# EAGLE design remotetool (EAGLE 7.0.0)
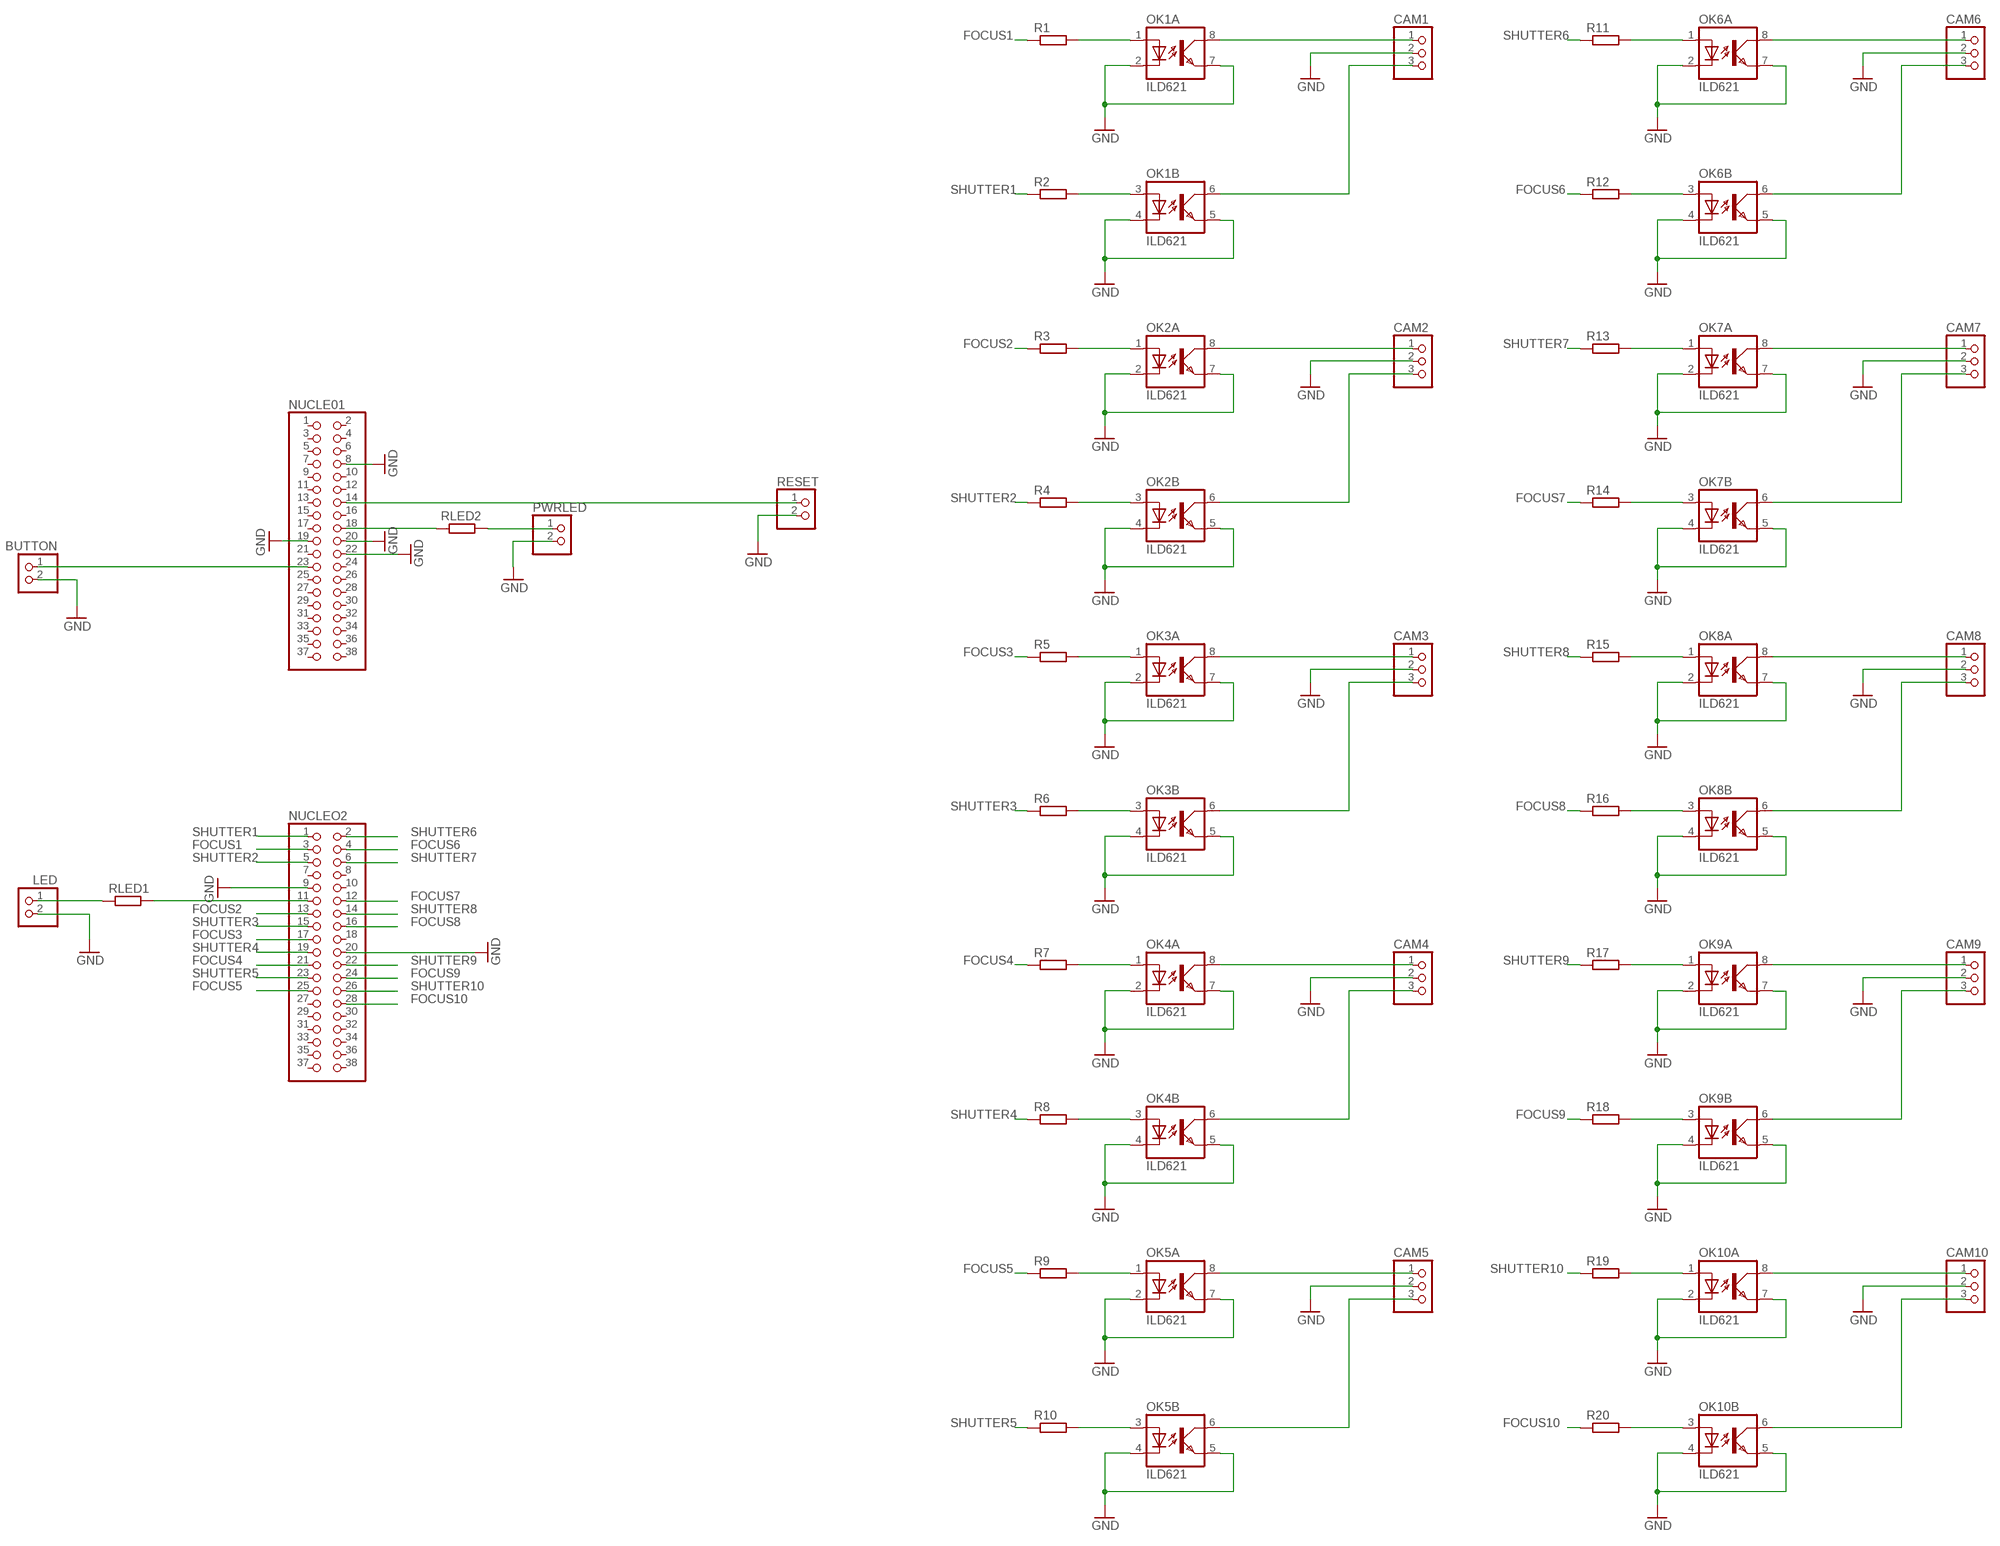
[diagram p0: schematic, sheet 1]

## Parts
BUTTON  PINHD-1X2  [1X02]
CAM1  PINHD-1X3  [1X03]
CAM2  PINHD-1X3  [1X03]
CAM3  PINHD-1X3  [1X03]
CAM4  PINHD-1X3  [1X03]
CAM5  PINHD-1X3  [1X03]
CAM6  PINHD-1X3  [1X03]
CAM7  PINHD-1X3  [1X03]
CAM8  PINHD-1X3  [1X03]
CAM9  PINHD-1X3  [1X03]
CAM10  PINHD-1X3  [1X03]
LED  PINHD-1X2  [1X02]
NUCLE01  PINHD-2X19  [2X19]
NUCLEO2  PINHD-2X19  [2X19]
OK1  ILD621  [DIL08]
OK2  ILD621  [DIL08]
OK3  ILD621  [DIL08]
OK4  ILD621  [DIL08]
OK5  ILD621  [DIL08]
OK6  ILD621  [DIL08]
OK7  ILD621  [DIL08]
OK8  ILD621  [DIL08]
OK9  ILD621  [DIL08]
OK10  ILD621  [DIL08]
PWRLED  PINHD-1X2  [1X02]
R1  R-EU_0207/2V  [0207/2V]
R2  R-EU_0207/2V  [0207/2V]
R3  R-EU_0207/2V  [0207/2V]
R4  R-EU_0207/2V  [0207/2V]
R5  R-EU_0207/2V  [0207/2V]
R6  R-EU_0207/2V  [0207/2V]
R7  R-EU_0207/2V  [0207/2V]
R8  R-EU_0207/2V  [0207/2V]
R9  R-EU_0207/2V  [0207/2V]
R10  R-EU_0207/2V  [0207/2V]
R11  R-EU_0207/2V  [0207/2V]
R12  R-EU_0207/2V  [0207/2V]
R13  R-EU_0207/2V  [0207/2V]
R14  R-EU_0207/2V  [0207/2V]
R15  R-EU_0207/2V  [0207/2V]
R16  R-EU_0207/2V  [0207/2V]
R17  R-EU_0207/2V  [0207/2V]
R18  R-EU_0207/2V  [0207/2V]
R19  R-EU_0207/2V  [0207/2V]
R20  R-EU_0207/2V  [0207/2V]
RESET  PINHD-1X2  [1X02]
RLED1  R-EU_0207/2V  [0207/2V]
RLED2  R-EU_0207/2V  [0207/2V]

## Nets
FOCUS1: NUCLEO2.3 R1.1
FOCUS2: NUCLEO2.13 R3.1
FOCUS3: NUCLEO2.17 R5.1
FOCUS4: NUCLEO2.21 R7.1
FOCUS5: NUCLEO2.25 R9.1
FOCUS6: NUCLEO2.4 R12.1
FOCUS7: NUCLEO2.12 R14.1
FOCUS8: NUCLEO2.16 R16.1
FOCUS9: NUCLEO2.24 R18.1
FOCUS10: NUCLEO2.28 R20.1
GND: BUTTON.2 CAM1.2 CAM2.2 CAM3.2 CAM4.2 CAM5.2 CAM6.2 CAM7.2 CAM8.2 CAM9.2 CAM10.2 LED.2 NUCLE01.8 NUCLE01.19 NUCLE01.20 NUCLE01.22 NUCLEO2.9 NUCLEO2.20 OK1.2(A:C) OK1.4(B:C) OK1.5(B:EMIT) OK1.7(A:EMIT) OK2.2(A:C) OK2.4(B:C) OK2.5(B:EMIT) OK2.7(A:EMIT) OK3.2(A:C) OK3.4(B:C) OK3.5(B:EMIT) OK3.7(A:EMIT) OK4.2(A:C) OK4.4(B:C) OK4.5(B:EMIT) OK4.7(A:EMIT) OK5.2(A:C) OK5.4(B:C) OK5.5(B:EMIT) OK5.7(A:EMIT) OK6.2(A:C) OK6.4(B:C) OK6.5(B:EMIT) OK6.7(A:EMIT) OK7.2(A:C) OK7.4(B:C) OK7.5(B:EMIT) OK7.7(A:EMIT) OK8.2(A:C) OK8.4(B:C) OK8.5(B:EMIT) OK8.7(A:EMIT) OK9.2(A:C) OK9.4(B:C) OK9.5(B:EMIT) OK9.7(A:EMIT) OK10.2(A:C) OK10.4(B:C) OK10.5(B:EMIT) OK10.7(A:EMIT) PWRLED.2 RESET.2
N$1: OK1.1(A:A) R1.2
N$2: OK1.3(B:A) R2.2
N$3: CAM1.1 OK1.8(A:COL)
N$4: CAM1.3 OK1.6(B:COL)
N$5: OK2.1(A:A) R3.2
N$6: OK2.3(B:A) R4.2
N$7: CAM2.1 OK2.8(A:COL)
N$8: CAM2.3 OK2.6(B:COL)
N$9: OK3.1(A:A) R5.2
N$10: OK3.3(B:A) R6.2
N$11: CAM3.1 OK3.8(A:COL)
N$12: CAM3.3 OK3.6(B:COL)
N$13: OK4.1(A:A) R7.2
N$14: OK4.3(B:A) R8.2
N$15: CAM4.1 OK4.8(A:COL)
N$16: CAM4.3 OK4.6(B:COL)
N$17: OK5.1(A:A) R9.2
N$18: OK5.3(B:A) R10.2
N$19: CAM5.1 OK5.8(A:COL)
N$20: CAM5.3 OK5.6(B:COL)
N$21: OK6.1(A:A) R11.2
N$22: OK6.3(B:A) R12.2
N$23: CAM6.1 OK6.8(A:COL)
N$24: CAM6.3 OK6.6(B:COL)
N$25: OK7.1(A:A) R13.2
N$26: OK7.3(B:A) R14.2
N$27: CAM7.1 OK7.8(A:COL)
N$28: CAM7.3 OK7.6(B:COL)
N$29: OK8.1(A:A) R15.2
N$30: OK8.3(B:A) R16.2
N$31: CAM8.1 OK8.8(A:COL)
N$32: CAM8.3 OK8.6(B:COL)
N$33: OK9.1(A:A) R17.2
N$34: OK9.3(B:A) R18.2
N$35: CAM9.1 OK9.8(A:COL)
N$36: CAM9.3 OK9.6(B:COL)
N$37: OK10.1(A:A) R19.2
N$38: OK10.3(B:A) R20.2
N$39: CAM10.1 OK10.8(A:COL)
N$40: CAM10.3 OK10.6(B:COL)
N$41: NUCLEO2.11 RLED1.2
N$42: BUTTON.1 NUCLE01.23
N$43: NUCLE01.14 RESET.1
N$44: LED.1 RLED1.1
N$45: NUCLE01.18 RLED2.2
N$46: PWRLED.1 RLED2.1
SHUTTER1: NUCLEO2.1 R2.1
SHUTTER2: NUCLEO2.5 R4.1
SHUTTER3: NUCLEO2.15 R6.1
SHUTTER4: NUCLEO2.19 R8.1
SHUTTER5: NUCLEO2.23 R10.1
SHUTTER6: NUCLEO2.2 R11.1
SHUTTER7: NUCLEO2.6 R13.1
SHUTTER8: NUCLEO2.14 R15.1
SHUTTER9: NUCLEO2.22 R17.1
SHUTTER10: NUCLEO2.26 R19.1
Unconnected: NUCLE01.1 NUCLE01.2 NUCLE01.3 NUCLE01.4 NUCLE01.5 NUCLE01.6 NUCLE01.7 NUCLE01.9 NUCLE01.10 NUCLE01.11 NUCLE01.12 NUCLE01.13 NUCLE01.15 NUCLE01.16 NUCLE01.17 NUCLE01.21 NUCLE01.24 NUCLE01.25 NUCLE01.26 NUCLE01.27 NUCLE01.28 NUCLE01.29 NUCLE01.30 NUCLE01.31 NUCLE01.32 NUCLE01.33 NUCLE01.34 NUCLE01.35 NUCLE01.36 NUCLE01.37 NUCLE01.38 NUCLEO2.7 NUCLEO2.8 NUCLEO2.10 NUCLEO2.18 NUCLEO2.27 NUCLEO2.29 NUCLEO2.30 NUCLEO2.31 NUCLEO2.32 NUCLEO2.33 NUCLEO2.34 NUCLEO2.35 NUCLEO2.36 NUCLEO2.37 NUCLEO2.38

## Library data of the parts
BUTTON LED PWRLED RESET = pinhead:PINHD-1X2: PIN HEADER
CAM1-CAM10 = pinhead:PINHD-1X3: PIN HEADER
NUCLE01 NUCLEO2 = pinhead:PINHD-2X19: PIN HEADER
OK1-OK10 = optocoupler:ILD621: SIEMENS OPTO COUPLER; MF: VISHAY/TELEFUNKEN; MPN: ILD621; OC_FARNELL: 1020151; OC_NEWARK: 58K1678
R1-R20 RLED1 RLED2 = resistor:R-EU_: RESISTOR, European symbol

## Board
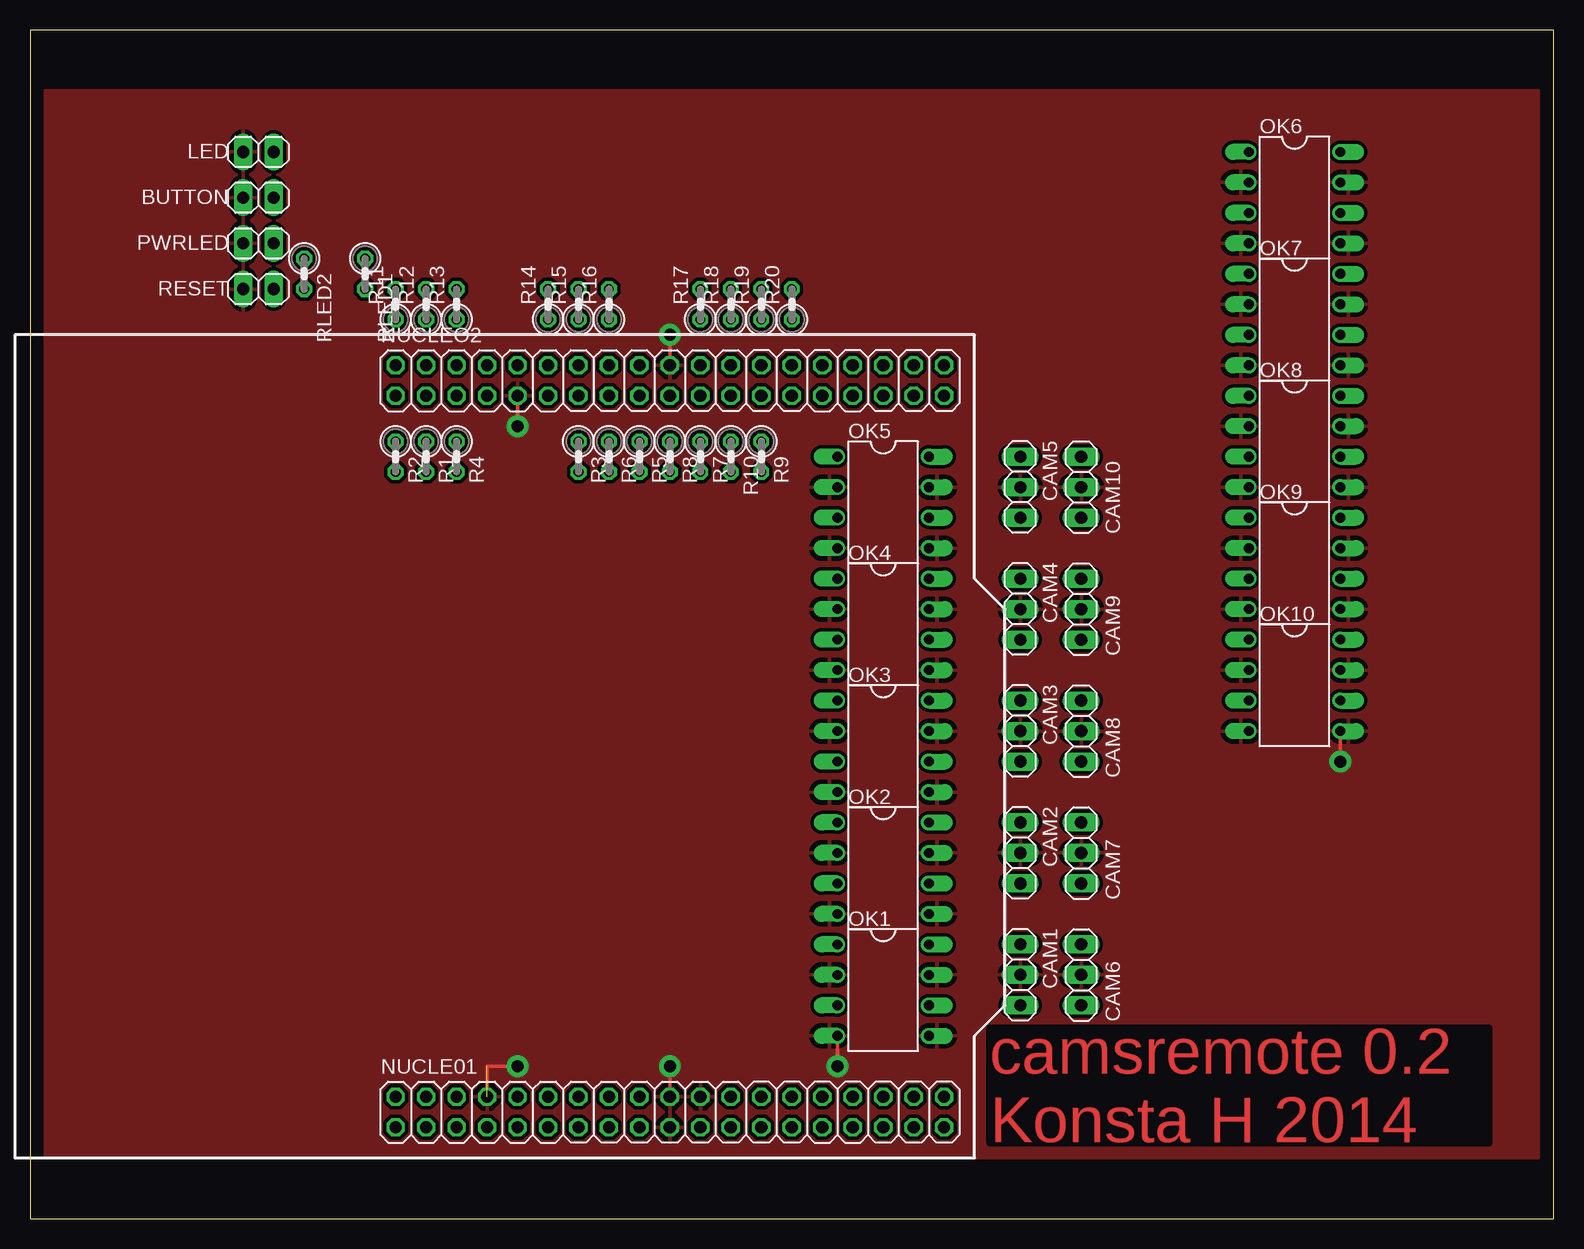
[diagram p1: board, top side]
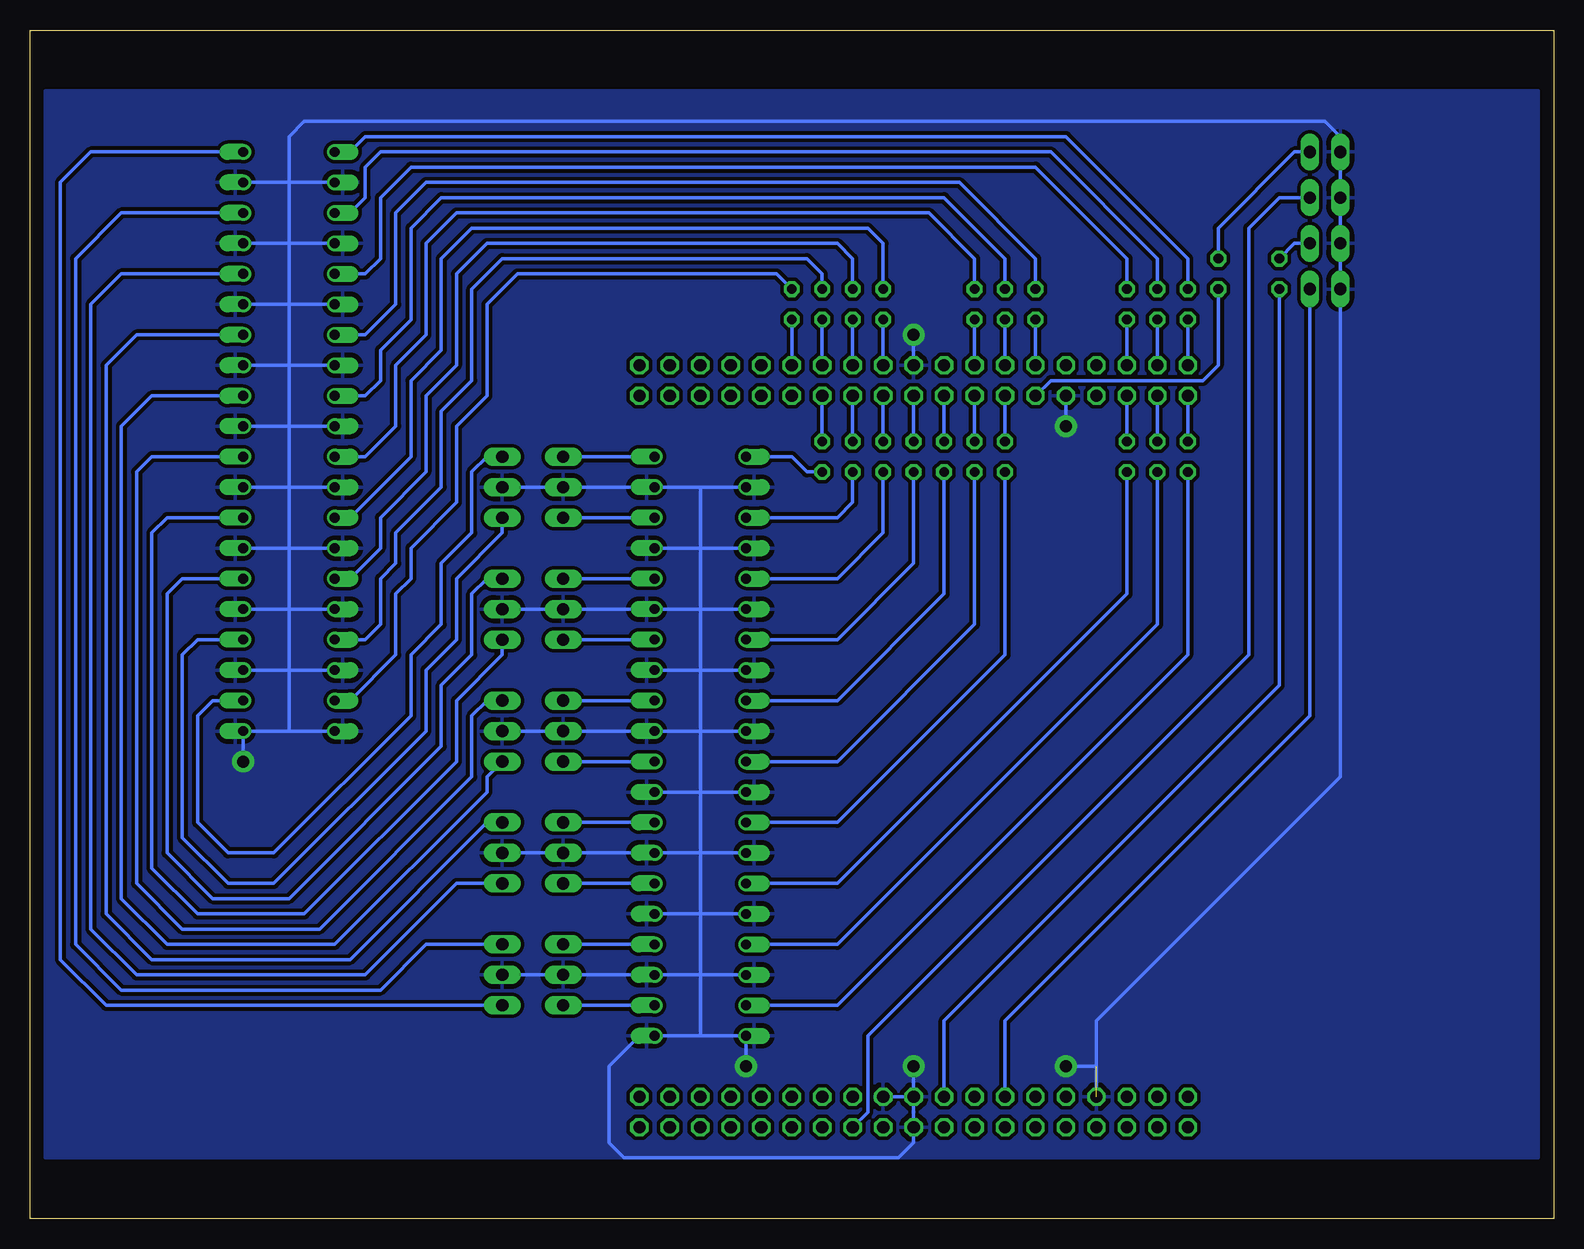
[diagram p2: board, bottom side, seen from below]

Size 127 x 99.06 mm. Coordinates in mm from the lower left corner, seen from the top.
Outline: 0,0 127,0 127,99.06 0,99.06 0,0
Copper layers (1*16): Top 0.035mm / dielectric 1.5mm / Bottom 0.035mm
Design rules "default *": minimum track width 10mil, minimum drill 24mil, track to track 12mil, track to pad 12mil, pad to pad 12mil, via to via 12mil, smd to smd 10mil, copper to edge 40mil, drill to drill 16mil, minimum pad ring 10mil, minimum via ring 16mil, stop-mask expansion 4mil, vias tented up to drill 0mil, thermal gap 16mil

### Footprints (pad centres in the part's own frame; a part is rotated, then mirrored left to right if it is on the bottom)
1X02 = drill 1.016 long: 1 -1.27,0; 2 1.27,0
1X03 = drill 1.016 long: 1 -2.54,0; 2 0,0; 3 2.54,0
2X19 = drill 1.016 octagon: 1 -22.86,-1.27; 2 -22.86,1.27; 3 -20.32,-1.27; 4 -20.32,1.27; 5 -17.78,-1.27; 6 -17.78,1.27; 7 -15.24,-1.27; 8 -15.24,1.27; 9 -12.7,-1.27; 10 -12.7,1.27; 11 -10.16,-1.27; 12 -10.16,1.27; 13 -7.62,-1.27; 14 -7.62,1.27; 15 -5.08,-1.27; 16 -5.08,1.27; 17 -2.54,-1.27; 18 -2.54,1.27; 19 0,-1.27; 20 0,1.27; 21 2.54,-1.27; 22 2.54,1.27; 23 5.08,-1.27; 24 5.08,1.27; 25 7.62,-1.27; 26 7.62,1.27; 27 10.16,-1.27; 28 10.16,1.27; 29 12.7,-1.27; 30 12.7,1.27; 31 15.24,-1.27; 32 15.24,1.27; 33 17.78,-1.27; 34 17.78,1.27; 35 20.32,-1.27; 36 20.32,1.27; 37 22.86,-1.27; 38 22.86,1.27
DIL08 = drill 0.813 offset: 1 -3.81,-3.81; 2 -1.27,-3.81; 3 1.27,-3.81; 4 3.81,-3.81; 5 3.81,3.81; 6 1.27,3.81; 7 -1.27,3.81; 8 -3.81,3.81
0207/2V = drill 0.813 octagon: 1 -1.27,0; 2 1.27,0

### Placement (x,y rotation side)
BUTTON  19.05,85.09 180 top
CAM1  82.55,20.32 270 top
CAM2  82.55,30.48 270 top
CAM3  82.55,40.64 270 top
CAM4  82.55,50.8 270 top
CAM5  82.55,60.96 270 top
CAM6  87.63,20.32 90 top
CAM7  87.63,30.48 90 top
CAM8  87.63,40.64 90 top
CAM9  87.63,50.8 90 top
CAM10  87.63,60.96 90 top
LED  19.05,88.9 180 top
NUCLE01  53.34,8.89 0 top
NUCLEO2  53.34,69.85 0 top
OK1  71.12,19.05 270 top
OK2  71.12,29.21 270 top
OK3  71.12,39.37 270 top
OK4  71.12,49.53 270 top
OK5  71.12,59.69 270 top
OK6  105.41,85.09 270 top
OK7  105.41,74.93 270 top
OK8  105.41,64.77 270 top
OK9  105.41,54.61 270 top
OK10  105.41,44.45 270 top
PWRLED  19.05,81.28 180 top
R1  33.02,63.5 270 top
R2  30.48,63.5 270 top
R3  45.72,63.5 270 top
R4  35.56,63.5 270 top
R5  50.8,63.5 270 top
R6  48.26,63.5 270 top
R7  55.88,63.5 270 top
R8  53.34,63.5 270 top
R9  60.96,63.5 270 top
R10  58.42,63.5 270 top
R11  30.48,76.2 90 top
R12  33.02,76.2 90 top
R13  35.56,76.2 90 top
R14  43.18,76.2 90 top
R15  45.72,76.2 90 top
R16  48.26,76.2 90 top
R17  55.88,76.2 90 top
R18  58.42,76.2 90 top
R19  60.96,76.2 90 top
R20  63.5,76.2 90 top
RESET  19.05,77.47 180 top
RLED1  27.94,78.74 270 top
RLED2  22.86,78.74 270 top

### Tracks (layer width: path | path; a pad name or v marks a point on that pad's centre or on a via)
FOCUS1
  Bottom 0.305: R1.1 NUCLEO2.3
FOCUS2
  Bottom 0.305: NUCLEO2.13 R3.1
FOCUS3
  Bottom 0.305: NUCLEO2.17 R5.1
FOCUS4
  Bottom 0.305: NUCLEO2.21 R7.1
FOCUS5
  Bottom 0.305: NUCLEO2.25 R9.1
FOCUS6
  Bottom 0.305: R12.1 NUCLEO2.4
FOCUS7
  Bottom 0.305: R14.1 NUCLEO2.12
FOCUS8
  Bottom 0.305: R16.1 NUCLEO2.16
FOCUS9
  Bottom 0.305: R18.1 NUCLEO2.24
FOCUS10
  Bottom 0.305: R20.1 NUCLEO2.28
GND  (via drill 1, 1 pad 1.27)  (1 unrouted)
  Top 0.305: v53.34,12.7 NUCLE01.20 | v40.64,12.7 38.1,12.7 NUCLE01.8 | v40.64,66.04 NUCLEO2.9 | v53.34,73.66 NUCLEO2.20 | v109.22,38.1 OK10.5 | v67.31,12.7 OK1.4
  Bottom 0.305: NUCLE01.20 NUCLE01.22 | NUCLE01.20 NUCLE01.19 53.34,6.35 54.61,5.08 77.47,5.08 78.74,6.35 78.74,12.7 76.2,15.24 OK1.5 71.12,15.24 | v53.34,73.66 NUCLEO2.20 | NUCLEO2.9 v40.64,66.04 | CAM10.2 CAM5.2 OK5.7 71.12,60.96 | CAM9.2 CAM4.2 OK4.7 71.12,50.8 | CAM8.2 CAM3.2 OK3.7 71.12,40.64 | CAM7.2 CAM2.2 OK2.7 71.12,30.48 | CAM6.2 CAM1.2 OK1.7 71.12,20.32 | 105.41,86.36 105.41,90.17 104.14,91.44 19.05,91.44 17.78,90.17 LED.2 BUTTON.2 PWRLED.2 RESET.2 17.78,36.83 38.1,16.51 38.1,12.7 | 105.41,86.36 OK6.2 | OK6.7 105.41,86.36 | 105.41,86.36 105.41,81.28 | 105.41,81.28 105.41,76.2 | 105.41,76.2 105.41,71.12 | 105.41,71.12 105.41,66.04 | 105.41,66.04 105.41,60.96 | 105.41,60.96 105.41,55.88 | 105.41,55.88 105.41,50.8 | 105.41,50.8 105.41,45.72 | 105.41,45.72 105.41,40.64 | 105.41,40.64 OK10.5 v109.22,38.1 | OK10.4 105.41,40.64 | OK10.2 105.41,45.72 | OK9.4 105.41,50.8 | OK9.5 105.41,50.8 | OK10.7 105.41,45.72 | OK9.7 105.41,55.88 | OK9.2 105.41,55.88 | OK8.4 105.41,60.96 | OK8.5 105.41,60.96 | OK8.2 105.41,66.04 | 105.41,66.04 OK8.7 | OK7.5 105.41,71.12 | OK7.4 105.41,71.12 | OK7.2 105.41,76.2 | OK7.7 105.41,76.2 | OK6.4 105.41,81.28 | OK6.5 105.41,81.28 | 71.12,15.24 OK1.4 v67.31,12.7 | 71.12,15.24 71.12,20.32 | 71.12,20.32 71.12,25.4 | 71.12,25.4 71.12,30.48 | 71.12,30.48 71.12,35.56 | 71.12,35.56 71.12,40.64 | 71.12,40.64 71.12,45.72 | 71.12,45.72 71.12,50.8 | 71.12,50.8 71.12,55.88 | 71.12,55.88 71.12,60.96 | 71.12,60.96 OK5.2 | OK5.4 71.12,55.88 | OK5.5 71.12,55.88 | OK4.2 71.12,50.8 | OK4.4 71.12,45.72 | OK4.5 71.12,45.72 | OK3.2 71.12,40.64 | OK3.4 71.12,35.56 | OK3.5 71.12,35.56 | OK2.2 71.12,30.48 | OK2.4 71.12,25.4 | OK2.5 71.12,25.4 | OK1.2 71.12,20.32 | NUCLE01.8 38.1,12.7
  Bottom 0.305: NUCLE01.20 v53.34,12.7 | v40.64,12.7 38.1,12.7
  pour Top: 1.27,93.98 1.27,5.08 125.73,5.08 125.73,93.98
  pour Bottom: 1.27,93.98 125.73,93.98 125.73,5.08 1.27,5.08
N$1
  Bottom 0.305: R1.2 33.02,49.53 59.69,22.86 OK1.1
N$2
  Bottom 0.305: R2.2 30.48,46.99 59.69,17.78 OK1.3
N$3
  Bottom 0.305: CAM1.1 OK1.8
N$4
  Bottom 0.305: CAM1.3 OK1.6
N$5
  Bottom 0.305: R3.2 45.72,46.99 59.69,33.02 OK2.1
N$6
  Bottom 0.305: R4.2 35.56,52.07 59.69,27.94 OK2.3
N$7
  Bottom 0.305: CAM2.1 OK2.8
N$8
  Bottom 0.305: CAM2.3 OK2.6
N$9
  Bottom 0.305: R5.2 50.8,52.07 59.69,43.18 OK3.1
N$10
  Bottom 0.305: R6.2 48.26,49.53 59.69,38.1 OK3.3
N$11
  Bottom 0.305: CAM3.1 OK3.8
N$12
  Bottom 0.305: CAM3.3 OK3.6
N$13
  Bottom 0.305: R7.2 55.88,57.15 59.69,53.34 OK4.1
N$14
  Bottom 0.305: R8.2 53.34,54.61 59.69,48.26 OK4.3
N$15
  Bottom 0.305: CAM4.1 OK4.8
N$16
  Bottom 0.305: CAM4.3 OK4.6
N$17
  Bottom 0.305: R9.2 62.23,62.23 63.5,63.5 OK5.1
N$18
  Bottom 0.305: R10.2 58.42,59.69 59.69,58.42 OK5.3
N$19
  Bottom 0.305: CAM5.1 OK5.8
N$20
  Bottom 0.305: CAM5.3 OK5.6
N$21
  Bottom 0.305: R11.2 30.48,80.01 40.64,90.17 99.06,90.17 100.33,88.9 OK6.1
N$22
  Bottom 0.305: OK6.3 100.33,83.82 99.06,85.09 99.06,87.63 97.79,88.9 41.91,88.9 33.02,80.01 R12.2
N$23
  Bottom 0.305: OK6.8 121.92,88.9 124.46,86.36 124.46,21.59 120.65,17.78 CAM6.1
N$24
  Bottom 0.305: OK6.6 119.38,83.82 123.19,80.01 123.19,22.86 119.38,19.05 97.79,19.05 93.98,22.86 CAM6.3
N$25
  Bottom 0.305: OK7.1 99.06,78.74 97.79,80.01 97.79,85.09 95.25,87.63 43.18,87.63 35.56,80.01 R13.2
N$26
  Bottom 0.305: OK7.3 99.06,73.66 96.52,76.2 96.52,83.82 93.98,86.36 49.53,86.36 43.18,80.01 R14.2
N$27
  Bottom 0.305: OK7.8 119.38,78.74 121.92,76.2 121.92,24.13 118.11,20.32 99.06,20.32 91.44,27.94 CAM7.1
N$28
  Bottom 0.305: OK7.6 118.11,73.66 120.65,71.12 120.65,25.4 116.84,21.59 100.33,21.59 88.9,33.02 CAM7.3
N$29
  Bottom 0.305: OK8.1 99.06,68.58 97.79,69.85 97.79,72.39 95.25,74.93 95.25,82.55 92.71,85.09 50.8,85.09 45.72,80.01 R15.2
N$30
  Bottom 0.305: OK8.3 99.06,63.5 96.52,66.04 96.52,71.12 93.98,73.66 93.98,81.28 91.44,83.82 52.07,83.82 48.26,80.01 R16.2
N$31
  Bottom 0.305: OK8.8 116.84,68.58 119.38,66.04 119.38,26.67 115.57,22.86 101.6,22.86 88.9,35.56 88.9,36.83 CAM8.1
N$32
  Bottom 0.305: OK8.6 116.84,63.5 118.11,62.23 118.11,27.94 114.3,24.13 102.87,24.13 90.17,36.83 90.17,41.91 88.9,43.18 CAM8.3
N$33
  Bottom 0.305: R17.2 55.88,81.28 57.15,82.55 90.17,82.55 92.71,80.01 92.71,72.39 95.25,69.85 95.25,63.5 100.33,58.42 OK9.1
N$34
  Bottom 0.305: R18.2 58.42,80.01 59.69,81.28 88.9,81.28 91.44,78.74 91.44,71.12 93.98,68.58 93.98,62.23 97.79,58.42 97.79,55.88 100.33,53.34 OK9.3
N$35
  Bottom 0.305: OK9.8 115.57,58.42 116.84,57.15 116.84,29.21 113.03,25.4 104.14,25.4 91.44,38.1 91.44,43.18 87.63,46.99 CAM9.1
N$36
  Bottom 0.305: OK9.6 114.3,53.34 115.57,52.07 115.57,30.48 111.76,26.67 105.41,26.67 92.71,39.37 92.71,44.45 90.17,46.99 90.17,52.07 88.9,53.34 CAM9.3
N$37
  Bottom 0.305: OK10.1 99.06,48.26 97.79,49.53 97.79,53.34 96.52,54.61 96.52,57.15 92.71,60.96 92.71,67.31 90.17,69.85 90.17,77.47 87.63,80.01 62.23,80.01 60.96,78.74 R19.2
N$38
  Bottom 0.305: OK10.3 100.33,43.18 96.52,46.99 96.52,52.07 95.25,53.34 95.25,55.88 91.44,59.69 91.44,66.04 88.9,68.58 88.9,76.2 86.36,78.74 64.77,78.74 R20.2
N$39
  Bottom 0.305: OK10.8 113.03,48.26 114.3,46.99 114.3,31.75 110.49,27.94 106.68,27.94 93.98,40.64 93.98,45.72 91.44,48.26 91.44,53.34 87.63,57.15 CAM10.1
N$40
  Bottom 0.305: CAM10.3 88.9,63.5 90.17,62.23 90.17,57.15 92.71,54.61 92.71,49.53 95.25,46.99 95.25,41.91 106.68,30.48 110.49,30.48 113.03,33.02 113.03,41.91 111.76,43.18 OK10.6
N$41
  Bottom 0.305: RLED1.2 27.94,71.12 29.21,69.85 41.91,69.85 NUCLEO2.11
N$42
  Bottom 0.305: NUCLE01.23 57.15,8.89 57.15,15.24 25.4,46.99 25.4,82.55 22.86,85.09 BUTTON.1
N$43
  Bottom 0.305: NUCLE01.14 45.72,16.51 20.32,41.91 RESET.1
N$44
  Bottom 0.305: LED.1 21.59,88.9 27.94,82.55 RLED1.1
N$45
  Bottom 0.305: NUCLE01.18 50.8,16.51 22.86,44.45 RLED2.2
N$46
  Bottom 0.305: RLED2.1 21.59,81.28 PWRLED.1
SHUTTER1
  Bottom 0.305: R2.1 NUCLEO2.1
SHUTTER2
  Bottom 0.305: R4.1 NUCLEO2.5
SHUTTER3
  Bottom 0.305: R6.1 NUCLEO2.15
SHUTTER4
  Bottom 0.305: R8.1 NUCLEO2.19
SHUTTER5
  Bottom 0.305: R10.1 NUCLEO2.23
SHUTTER6
  Bottom 0.305: R11.1 NUCLEO2.2
SHUTTER7
  Bottom 0.305: R13.1 NUCLEO2.6
SHUTTER8
  Bottom 0.305: R15.1 NUCLEO2.14
SHUTTER9
  Bottom 0.305: R17.1 NUCLEO2.22
SHUTTER10
  Bottom 0.305: R19.1 NUCLEO2.26

### Text on the board
Top: camsremote 0.2 / Konsta H 2014